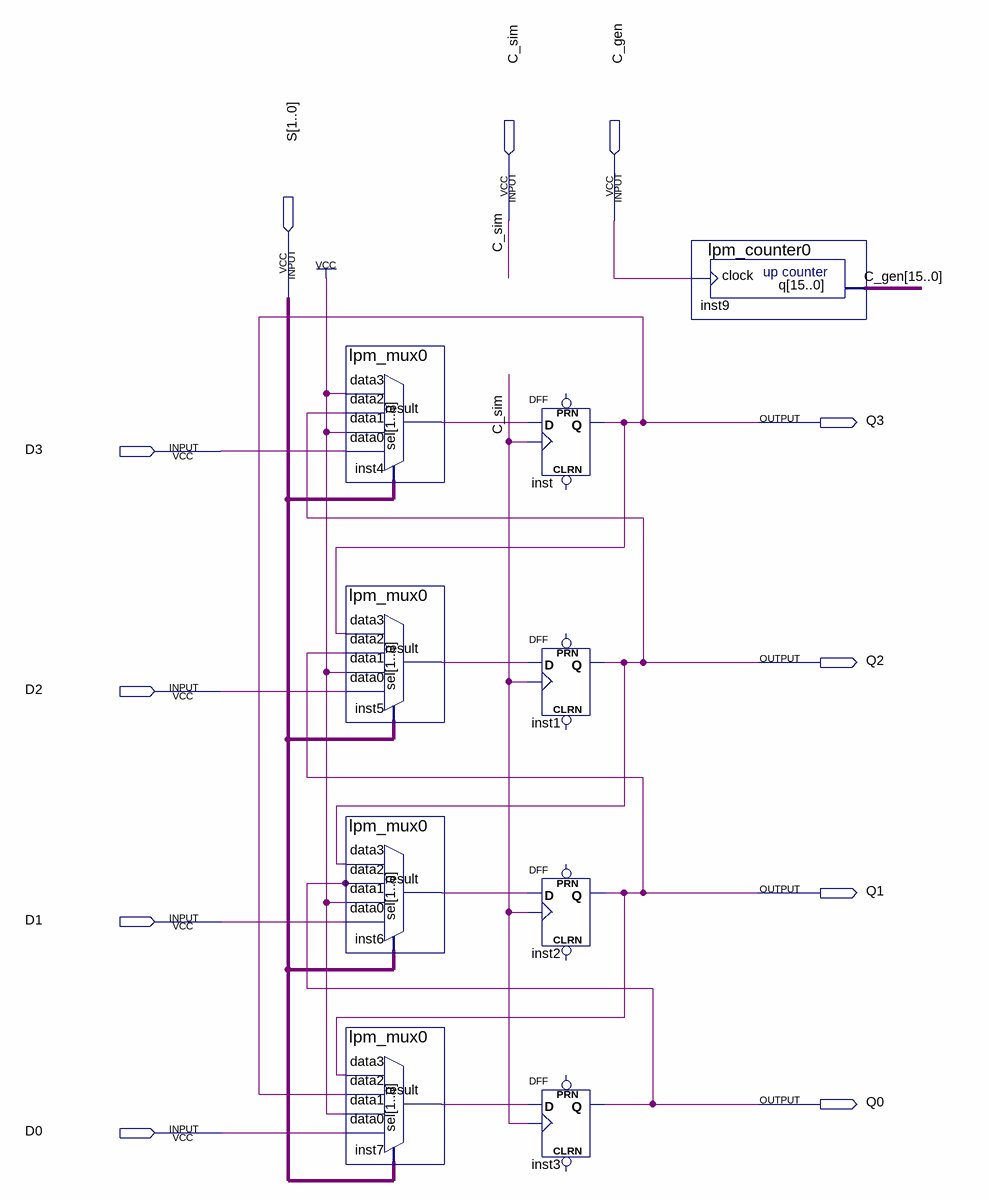
[diagram p0: schematic sheet]
// Quartus schematic lab5p2.bdf as structural Verilog: 9 symbols, 11 pins
module lab5p2 (
  input  C_sim,
  input  C_gen,
  input  [1:0] S,
  input  D3,
  input  D2,
  input  D1,
  input  D0,
  output Q3,
  output Q2,
  output Q1,
  output Q0
);

  wire inst4_result, inst5_result, inst6_result, inst7_result;
  wire [15:0] C_gen_bus;

  lpm_mux0 inst4 (.data3(1'b1), .data2(Q2), .data1(1'b1), .data0(D3), .sel(S), .result(inst4_result));
  lpm_mux0 inst5 (.data3(Q3), .data2(Q1), .data1(1'b1), .data0(D2), .sel(S), .result(inst5_result));
  lpm_mux0 inst6 (.data3(Q2), .data2(Q0), .data1(1'b1), .data0(D1), .sel(S), .result(inst6_result));
  lpm_mux0 inst7 (.data3(Q1), .data2(Q3), .data1(1'b1), .data0(D0), .sel(S), .result(inst7_result));
  DFF inst (.CLK(C_sim), .D(inst4_result), .Q(Q3));  // open: CLRN, PRN
  DFF inst1 (.CLK(C_sim), .D(inst5_result), .Q(Q2));  // open: CLRN, PRN
  DFF inst2 (.CLK(C_sim), .D(inst6_result), .Q(Q1));  // open: CLRN, PRN
  DFF inst3 (.CLK(C_sim), .D(inst7_result), .Q(Q0));  // open: CLRN, PRN
  lpm_counter0 inst9 (.clock(C_gen), .q(C_gen_bus));
endmodule
